# Altium schematic sheet GraduatedDesign_03.SchDoc
size A3; DocumentNumber: 1; SheetNumber: 1; SheetTotal: 1
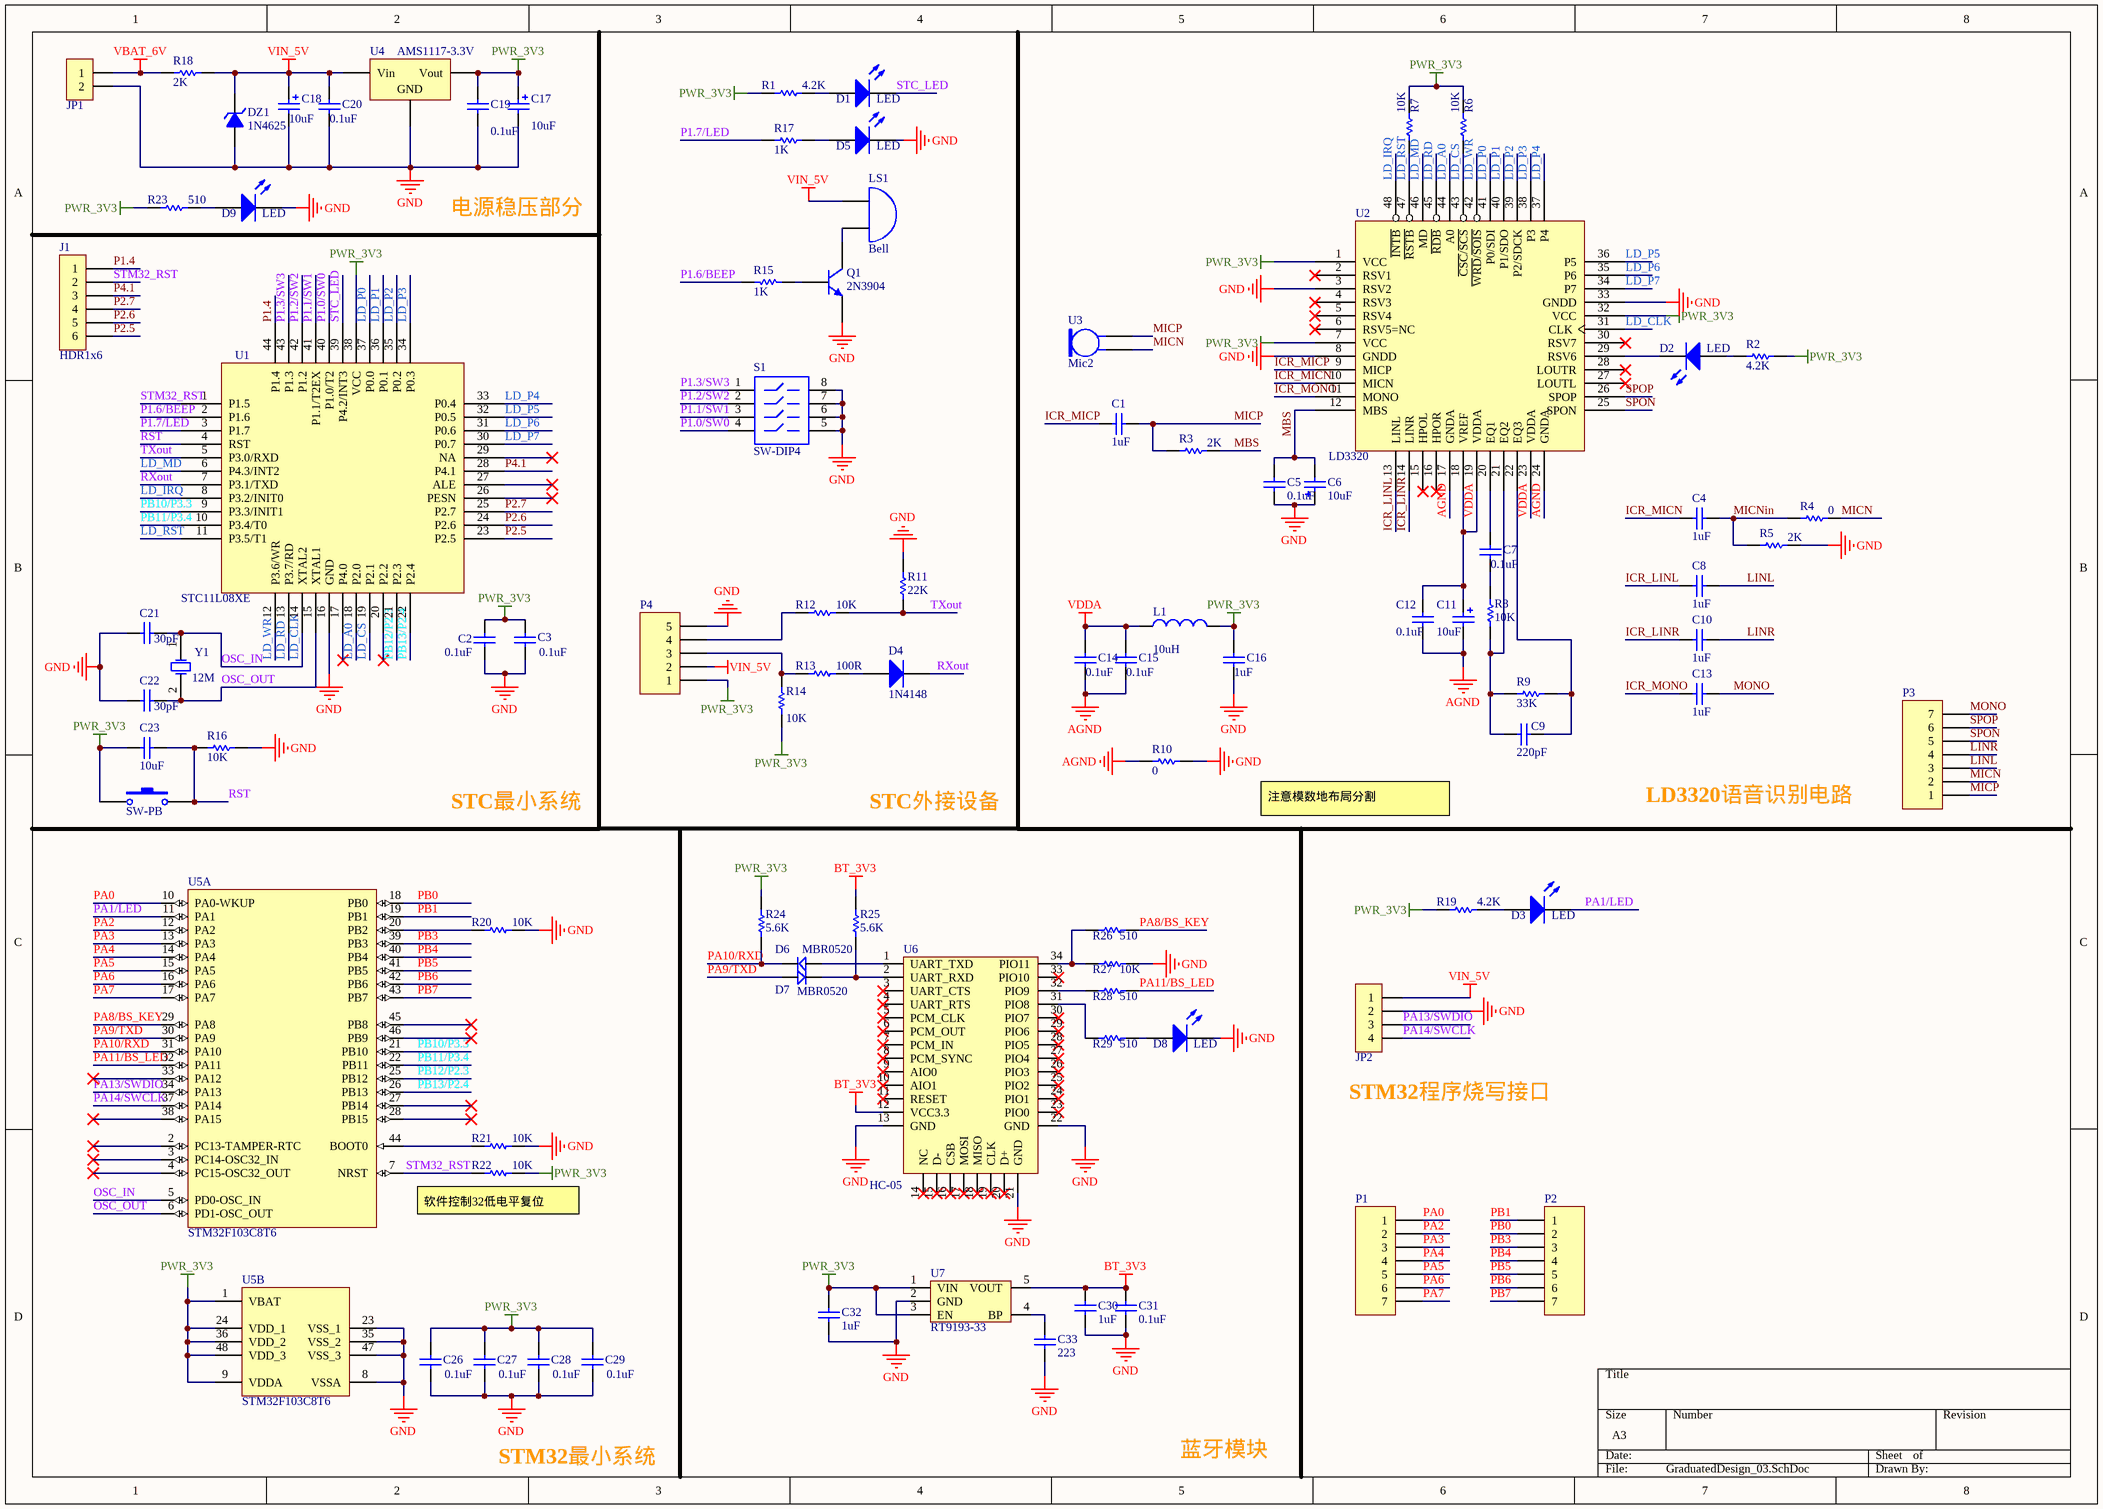
[diagram p0: GraduatedDesign_03.SchDoc]

## Parts
C1  value 1uF  [C0603]  (hidden comment: Cap)
C2  value 0.1uF  [C0603]  (hidden comment: Cap)
C3  value 0.1uF  [C0603]  (hidden comment: Cap)
C4  value 1uF  [C0603]  (hidden comment: Cap)
C5  value 0.1uF  [C0603]  (hidden comment: Cap)
C6  value 10uF  [C3216]  (hidden comment: Cap Pol2)
C7  value 0.1uF  [C0603]  (hidden comment: Cap)
C8  value 1uF  [C0603]  (hidden comment: Cap)
C9  value 220pF  [C0603]  (hidden comment: Cap)
C10  value 1uF  [C0603]  (hidden comment: Cap)
C11  value 10uF  [C3216]  (hidden comment: Cap Pol2)
C12  value 0.1uF  [C0603]  (hidden comment: Cap)
C13  value 1uF  [C0603]  (hidden comment: Cap)
C14  value 0.1uF  [C0603]  (hidden comment: Cap)
C15  value 0.1uF  [C0603]  (hidden comment: Cap)
C16  value 1uF  [C0603]  (hidden comment: Cap)
C17  value 10uF  [C3216]  (hidden comment: Cap Pol2)
C18  value 10uF  [C3216]  (hidden comment: Cap Pol2)
C19  value 0.1uF  [C0603]  (hidden comment: Cap)
C20  value 0.1uF  [C0603]  (hidden comment: Cap)
C21  value 30pF  [C0603]  (hidden comment: Cap)
C22  value 30pF  [C0603]  (hidden comment: Cap)
C23  value 10uF  [C0603]  (hidden comment: Cap)
C26  value 0.1uF  [C0603]  (hidden comment: Cap)
C27  value 0.1uF  [C0603]  (hidden comment: Cap)
C28  value 0.1uF  [C0603]  (hidden comment: Cap)
C29  value 0.1uF  [C0603]  (hidden comment: Cap)
C30  value 1uF  [C0603]  (hidden comment: Cap)
C31  value 0.1uF  [C0603]  (hidden comment: Cap)
C32  value 1uF  [C0603]  (hidden comment: Cap)
C33  value 223  [C0603]  (hidden comment: Cap)
D1  LED  [0603LED_GREEN]
D2  LED  [0603LED_RED]
D3  LED  [0603LED_GREEN]
D4  1N4148  [D1206]
D5  LED  [0603LED_GREEN]
D6  MBR0520  [SOD-123]
D7  MBR0520  [SOD-123]
D8  LED  [0603LED_GREEN]
D9  LED  [0603LED_GREEN]
DZ1  1N4625  [SOD-323]
J1  HDR1x6  [HDR1X6]
JP1  HDR-1X2  [HDR1X2]  (value not drawn)
JP2  HDR-1X4  [HDR1X4]  (value not drawn)
L1  value 10uH  [L0805]  (hidden comment: Inductor)
LS1  Bell  [BELL]
P1  Header 7H  [HDR1X7]  (value not drawn)
P2  Header 7H  [HDR1X7]  (value not drawn)
P3  Header 7H  [HDR1X7]  (value not drawn)
P4  Header 5H  [HDR1X5]  (value not drawn)
Q1  2N3904  [SOT-23]
R1  value 4.2K  [R0603]  (hidden comment: Res1)
R2  value 4.2K  [R0603]  (hidden comment: Res1)
R3  value 2K  [R0603]  (hidden comment: Res1)
R4  value 0  [R0603]  (hidden comment: Res1)
R5  value 2K  [R0603]  (hidden comment: Res1)
R6  value 10K  [R0603]  (hidden comment: Res1)
R7  value 10K  [R0603]  (hidden comment: Res1)
R8  value 10K  [R0603]  (hidden comment: Res1)
R9  value 33K  [R0603]  (hidden comment: Res1)
R10  value 0  [R0603]  (hidden comment: Res1)
R11  value 22K  [R0603]  (hidden comment: Res Semi)
R12  value 10K  [R0603]  (hidden comment: Res Semi)
R13  value 100R  [R0603]  (hidden comment: Res Semi)
R14  value 10K  [R0603]  (hidden comment: Res Semi)
R15  value 1K  [R0603]  (hidden comment: Res1)
R16  value 10K  [R0603]  (hidden comment: Res1)
R17  value 1K  [R0603]  (hidden comment: Res1)
R18  value 2K  [R0603]  (hidden comment: Res1)
R19  value 4.2K  [R0603]  (hidden comment: Res1)
R20  value 10K  [R0603]  (hidden comment: Res1)
R21  value 10K  [R0603]  (hidden comment: Res1)
R22  value 10K  [R0603]  (hidden comment: Res1)
R23  value 510  [R0603]  (hidden comment: Res1)
R24  value 5.6K  [R0603]  (hidden comment: Res1)
R25  value 5.6K  [R0603]  (hidden comment: Res1)
R26  value 510  [R0603]  (hidden comment: Res1)
R27  value 10K  [R0603]  (hidden comment: Res1)
R28  value 510  [R0603]  (hidden comment: Res1)
R29  value 510  [R0603]  (hidden comment: Res1)
S1  SW-DIP4  [DIP-8]
S2  SW-PB  [SPST-2]
U1  STC11L08XE  [QFP-44]
U2  LD3320  [LD3320A]
U3  Mic2  [PIN2]
U4  AMS1117-3.3V  [SOT223]
U5  STM32F103C8T6  [LQFP48_M]  (parts A,B of 2)
U6  HC-05  [HC-0x]
U7  RT9193-33  [SOT-23-5]
Y1  12M  [49/S_N]

## Nets
AGND: C11.2 C12.1 C14.1 C15.1 R10.2 U2.17(GNDA) U2.24(GNDA)
BT_3V3: C30.1 C31.1 R25.1 U6.12(VCC3.3) U7.5(VOUT)
GND: C2.1 C3.2 C5.2 C6.1 C16.1 C17.2 C18.2 C19.2 C20.1 C21.1 C22.1 C26.2 C27.2 C28.2 C29.2 C30.2 C31.2 C32.2 C33.2 D5.2(K) D8.2(K) D9.2(K) DZ1.1(A) JP1.2 JP2.2 P4.5 Q1.1(E) R5.2 R10.1 R11.2 R16.1 R20.1 R21.1 R27.1 S1.5 S1.6 S1.7 S1.8 U1.16(GND) U2.3(RSV2) U2.8(GNDD) U2.33(GNDD) U4.2(GND) U5.8(VSSA) U5.23(VSS_1) U5.35(VSS_2) U5.47(VSS_3) U6.13(GND) U6.21(GND) U6.22(GND) U7.2(GND)
PWR_3V3: C2.2 C3.1 C16.2 C17.1 C19.1 C23.2 C26.1 C27.1 C28.1 C29.1 C32.1 L1.2 P4.1 R1.1 R2.2 R6.1 R7.1 R14.2 R19.1 R22.1 R23.1 R24.1 S2.1 U1.38(VCC) U2.1(VCC) U2.7(VCC) U2.32(VCC) U4.3(Vout) U5.1(VBAT) U5.9(VDDA) U5.24(VDD_1) U5.36(VDD_2) U5.48(VDD_3) U7.1(VIN) U7.3(EN)
VBAT_6V: JP1.1 R18.2
VDDA: C11.1 C12.2 C14.2 C15.2 L1.1 U2.18(VREF) U2.19(VDDA) U2.23(VDDA)
VIN_5V: C18.1 C20.2 DZ1.2(K) JP2.1 LS1.2(B) P4.2 R18.1 U4.1(Vin)
ICR_LINL: C8.1 U2.13(LINL)
ICR_LINR: C10.1 U2.14(LINR)
ICR_MICN: C4.1 U2.10(MICN)
ICR_MICP: C1.1 U2.9(MICP)
ICR_MONO: C13.1 U2.11(MONO)
LD_A0: U1.18(P2.0) U2.44(A0)
LD_CLK: C21.2 U1.14(XTAL2) U2.31(CLK) U5.5(PD0-OSC_IN) Y1.1(OSC1)  [also labelled OSC_IN]
LD_CS: R6.2 U1.19(P2.1) U2.43(~{CSC}/~{SCS})
LD_IRQ: U1.8(P3.2/INIT0) U2.48(~{INTB})
LD_MD: U1.6(P4.3/INT2) U2.46(MD)
LD_P0: U1.37(P0.0) U2.41(P0/SDI)
LD_P1: U1.36(P0.1) U2.40(P1/SDO)
LD_P2: U1.35(P0.2) U2.39(P2/SDCK)
LD_P3: U1.34(P0.3) U2.38(P3)
LD_P4: U1.33(P0.4) U2.37(P4)
LD_P5: U1.32(P0.5) U2.36(P5)
LD_P6: U1.31(P0.6) U2.35(P6)
LD_P7: U1.30(P0.7) U2.34(P7)
LD_RD: U1.13(P3.7/RD) U2.45(~{RDB})
LD_RST: R7.2 U1.11(P3.5/T1) U2.47(~{RSTB})
LD_WR: U1.12(P3.6/WR) U2.42(~{WRD}/~{SOIS})
LINL: C8.2 P3.3
LINR: C10.2 P3.4
MBS: C5.1 C6.2 R3.2 U2.12(MBS)
MICN: P3.2 R4.2 U3.1
MICNin: C4.2 R4.1 R5.1
MICP: C1.2 P3.1 R3.1 U3.2
MONO: C13.2 P3.7
OSC_OUT: C22.2 U1.15(XTAL1) U5.6(PD1-OSC_OUT) Y1.2(OSC2)
P1.0/SW0: S1.4 U1.40(P1.0/T2)
P1.1/SW1: S1.3 U1.41(P1.1/T2EX)
P1.2/SW2: S1.2 U1.42(P1.2)
P1.3/SW3: S1.1 U1.43(P1.3)
P1.4: J1.1 U1.44(P1.4)
P1.6/BEEP: R15.1 U1.2(P1.6)
P1.7/LED: R17.1 U1.3(P1.7)
P2.5: J1.6 U1.23(P2.5)
P2.6: J1.5 U1.24(P2.6)
P2.7: J1.4 U1.25(P2.7)
P4.1: J1.3 U1.28(P4.1)
PA0: P1.1 U5.10(PA0-WKUP)
PA1/LED: D3.2(K) U5.11(PA1)
PA2: P1.2 U5.12(PA2)
PA3: P1.3 U5.13(PA3)
PA4: P1.4 U5.14(PA4)
PA5: P1.5 U5.15(PA5)
PA6: P1.6 U5.16(PA6)
PA7: P1.7 U5.17(PA7)
PA8/BS_KEY: R26.1 U5.29(PA8)
PA9/TXD: D7.1 U5.30(PA9)
PA10/RXD: D6.2 R24.2 U5.31(PA10)
PA11/BS_LED: R28.1 U5.32(PA11)
PA13/SWDIO: JP2.3 U5.34(PA13)
PA14/SWCLK: JP2.4 U5.37(PA14)
PB0: P2.2 U5.18(PB0)
PB1: P2.1 U5.19(PB1)
PB3: P2.3 U5.39(PB3)
PB4: P2.4 U5.40(PB4)
PB5: P2.5 U5.41(PB5)
PB6: P2.6 U5.42(PB6)
PB7: P2.7 U5.43(PB7)
PB10/P3.3: U1.9(P3.3/INIT1) U5.21(PB10)
PB11/P3.4: U1.10(P3.4/T0) U5.22(PB11)
PB12/P2.3: U1.21(P2.3) U5.25(PB12)
PB13/P2.4: U1.22(P2.4) U5.26(PB13)
RST: C23.1 R16.2 S2.2 U1.4(RST)
RXout: D4.2(K) U1.7(P3.1/TXD)
SPON: P3.5 U2.25(SPON)
SPOP: P3.6 U2.26(SPOP)
STC_LED: D1.2(K) U1.39(P4.2/INT3)
STM32_RST: J1.2 R22.2 U1.1(P1.5) U5.7(NRST)
TXout: R11.1 R12.2 U1.5(P3.0/RXD)
NetC7_1: C7.1 R8.2
NetC7_2: C7.2 U2.20(EQ1)
NetC9_1: C9.1 R9.1 U2.22(EQ3)
NetC9_2: C9.2 R8.1 R9.2 U2.21(EQ2)
NetC33_1: C33.1 U7.4(BP)
NetD1_1: D1.1(A) R1.2
NetD2_1: D2.1(A) R2.1
NetD2_2: D2.2(K) U2.29(RSV6)
NetD3_1: D3.1(A) R19.2
NetD4_1: D4.1(A) R13.2
NetD5_1: D5.1(A) R17.2
NetD6_1: D6.1 U6.1(UART_TXD)
NetD7_2: D7.2 R25.2 U6.2(UART_RXD)
NetD8_1: D8.1(A) R29.1
NetD9_1: D9.1(A) R23.2
NetLS1_1: LS1.1(A) Q1.3(C)
NetP4_3: P4.3 R13.1 R14.1
NetP4_4: P4.4 R12.1
NetQ1_2: Q1.2(B) R15.2
NetR20_2: R20.2 U5.20(PB2)
NetR21_2: R21.2 U5.44(BOOT0)
NetR26_2: R26.2 R27.2 U6.34(PIO11)
NetR28_2: R28.2 U6.32(PIO9)
NetR29_2: R29.2 U6.31(PIO8)

Not connected (* = marked no-connect by the designer): U1 17(P4.0)* 20(P2.2)* 26(PESN)* 27(ALE)* 29(NA)*; U2 2(RSV1)* 4(RSV3)* 5(RSV4)* 6(RSV5=NC)* 15(HPOL)* 16(HPOR)* 27(LOUTL)* 28(LOUTR)* 30(RSV7)*; U5 2(PC13-TAMPER-RTC)* 3(PC14-OSC32_IN)* 4(PC15-OSC32_OUT)* 27(PB14)* 28(PB15)* 33(PA12)* 38(PA15)* 45(PB8)* 46(PB9)*; U6 3(UART_CTS)* 4(UART_RTS)* 5(PCM_CLK)* 6(PCM_OUT)* 7(PCM_IN)* 8(PCM_SYNC)* 9(AIO0)* 10(AIO1)* 11(RESET)* 14(NC)* 15(D-)* 16(CSB)* 17(MOSI)* 18(MISO)* 19(CLK)* 20(D+)* 23(PIO0)* 24(PIO1)* 25(PIO2)* 26(PIO3)* 27(PIO4)* 28(PIO5)* 29(PIO6)* 30(PIO7)* 33(PIO10)*

## Notes on the sheet
- 电源稳压部分
- STC最小系统
- STC外接设备
- 注意模数地布局分割
- LD3320语音识别电路
- (near JP2) STM32程序烧写接口
- (near R22) 软件控制32低电平复位
- 蓝牙模块
- STM32最小系统

## Library data of the parts
C1-C5 C7-C10 C12-C16 C19-C23 C26-C33 = Cap: Capacitor; Published: 8-Jun-2000; LatestRevisionDate: 17-Jul-2002; LatestRevisionNote: Re-released for DXP Platform.; PackageReference: RAD-0.3; Publisher: Altium Limited; PackageDescription: Radial Cap, Thru-Hole; 2 Leads; 0.3 in Pin Spacing
C6 C11 C17 C18 = Cap Pol2: Polarized Capacitor (Axial); Published: 8-Jun-2000; LatestRevisionDate: 17-Jul-2002; LatestRevisionNote: Re-released for DXP Platform.; PackageReference: POLAR0.8; Publisher: Altium Limited; PackageDescription: Polarized Capacitor; 2 Leads
D1-D3 D5 D8 D9 = LED0: Typical INFRARED GaAs LED; Published: 8-Jun-2000; LatestRevisionDate: 08-Jul-2005; LatestRevisionNote: Mech Layer 1 removed.; PackageReference: LED-0; Publisher: Altium Limited; PackageDescription: LED; 2 Leads
D4 = Diode 1N4148: High Conductance Fast Diode; Published: 8-Jun-2000; LatestRevisionDate: 17-Jul-2002; LatestRevisionNote: Re-released for DXP Platform.; DatasheetVersion: 1997; PackageReference: DO-35; Publisher: Altium Limited; PackageDescription: Diode, Axial; Body 3.8 x 1.9 mm (LxDia. max), Lead Dia. 0.53 mm (max); Code_JEDEC: DO-204-AH; ComponentLink1Description: Manufacturer Link; ComponentLink1URL: http://www.fairchildsemi.com/; ComponentLink2Description: Datasheet; ComponentLink2URL: http://www.fairchildsemi.com/ds/1N%2F1N4148.pdf
D6 D7 = D: 1N4148
DZ1 = 1N4625: 5.1V/0.5W稳压管; 版权归属: 黎明电子style; BOM名称: 5.1V/0.5W稳压管; 学习资源: https://lmdzstyle.taobao.com/
J1 = HDR1x6: Connector
JP1 = Header 2: 2P接插件; 版权归属: 黎明电子style; BOM名称: 2P接插件; 学习资源: https://lmdzstyle.taobao.com/
JP2 = Header 4: 4P接插件; 版权归属: 黎明电子style; BOM名称: 4P接插件; 学习资源: https://lmdzstyle.taobao.com/
L1 = Inductor: Code_IEC: 1005; Published: 8-Jun-2000; LatestRevisionDate: 29-May-2009; LatestRevisionNote: IPC-7351 Footprint Added.; PackageReference: 0402-A; Publisher: Altium Limited; PackageDescription: Chip Inductor; Code_JEITA: 0402
LS1 = Bell: Electrical Bell; Published: 24-Mar-1999; LatestRevisionDate: 17-Jul-2002; LatestRevisionNote: Re-released for DXP Platform.; PackageReference: PIN2; Publisher: Altium Limited
P1-P3 = Header 7H: Header, 7-Pin, Right Angle; LatestRevisionDate: 17-Jul-2002; LatestRevisionNote: Re-released for DXP Platform.; Publisher: Altium Limited
P4 = Header 5H: Header, 5-Pin, Right Angle; LatestRevisionDate: 17-Jul-2002; LatestRevisionNote: Re-released for DXP Platform.; Publisher: Altium Limited
Q1 = 2N3904: NPN General Purpose Amplifier; Published: 8-Jun-2000; LatestRevisionDate: 15-Jan-2003; LatestRevisionNote: PCB Footprint 'BCY-W3/D4.7' replaced; DatasheetVersion: 1997; PackageVersion: Sep-1998; PackageReference: TO-92A; Publisher: Altium Limited; Code_JEDEC: TO-92A; ComponentLink1Description: Manufacturer Link; ComponentLink1URL: http://www.fairchildsemi.com/; ComponentLink2Description: Datasheet; ComponentLink2URL: http://www.fairchildsemi.com/ds/2N%2F2N3904.pdf
R1-R10 R15-R29 = Res1: Resistor; Published: 8-Jun-2000; LatestRevisionDate: 17-Jul-2002; LatestRevisionNote: Re-released for DXP Platform.; PackageReference: AXIAL-0.3; Publisher: Altium Limited; PackageDescription: Axial Device, Thru-Hole; 2 Leads; 0.3 in Pin Spacing
R11-R14 = Res Semi: Semiconductor Resistor; Published: 8-Jun-2000; LatestRevisionDate: 17-Jul-2002; LatestRevisionNote: Re-released for DXP Platform.; PackageReference: AXIAL-0.5; Publisher: Altium Limited; PackageDescription: Axial Device, Thru-Hole; 2 Leads; 0.5 in Pin Spacing
S1 = SW-DIP4: DIP Switch; Published: 24-Mar-1999; LatestRevisionDate: 17-Jul-2002; LatestRevisionNote: Re-released for DXP Platform.; PackageReference: DIP-8; Publisher: Altium Limited
S2 = SW-PB: Switch; Published: 24-Mar-1999; LatestRevisionDate: 17-Jul-2002; LatestRevisionNote: Re-released for DXP Platform.; PackageReference: SPST-2; Publisher: Altium Limited
U1 = STC11L08XE: STC11L08XE: U?
U2 = LD3320A
U3 = Mic2: Microphone; Published: 24-Mar-1999; LatestRevisionDate: 17-Jul-2002; LatestRevisionNote: Re-released for DXP Platform.; PackageReference: PIN2; Publisher: Altium Limited
U4 = Volt Reg: Voltage Regulator; Published: 24-Mar-1999; LatestRevisionDate: 29-May-2009; LatestRevisionNote: IPC-7351 Footprint Added.; PackageReference: D2PAK; Publisher: Altium Limited; PackageDescription: 3-Pin Transistor Outline Package 2.54 mm Pitch, 15.1 mm Lead Span
U5 = STM32F103C8T6: ARM Cortex-M3 32-bit MCU, 64 KB Flash, 20 KB Internal RAM, 37 I/Os, 48-pin LQFP, -40 to 85 degC, Tray; A/D Converter: 2x12-bit (10 Channel); FLASH Size (Prog) (kB): 64; I/Os (High Current): 37; Internal RAM Size (kB): 20; Operating Frequency(F) (Processor speed) (MHz): 72; Supply Voltage(Vcc) min (V): 2; DatasheetVersion: Rev. 16; PackageVersion: Rev. 6, 06/2013; PackageReference: LQFP48; PackageDescription: 48-Pin Low Profile Quad Flat Package, 7 x 7 mm Body, 0.5 mm Pitch; Supplier 1: Digi-Key; Supplier Part Number 1: 497-6063-ND; Supplier 2: Farnell; Supplier Part Number 2: 1447637; Supplier 3: Newark; Supplier Part Number 3: 59M2182; Supplier 4: Newark; Supplier Part Number 4: 57P1222; Supplier 5: Mouser; Supplier Part Number 5: 511-STM32F103C8T6; Core: ARM Cortex-M3; Packing: Tray; Mounting Technology: Surface Mount; PartNumber: STM32F103C8T6; ComponentLink1Description: Manufacturer URL; ComponentLink1URL: http://www.st.com/web/en/home.html; ComponentLink2Description: Datasheet; ComponentLink2URL: http://www.st.com/st-web-ui/static/active/en/resource/technical/document/datasheet/CD00161566.pdf; ComponentLink3Description: Package Specification; ComponentLink3URL: http://www.st.com/st-web-ui/static/active/en/resource/technical/document/datasheet/DM00058181.pdf
U6 = HC-05: 蓝牙串口模块
U7 = RT9193-33: 3.3V超低压差LDO
Y1 = XTAL: Crystal Oscillator; Published: 8-Jun-2000; LatestRevisionDate: 17-Jul-2002; LatestRevisionNote: Re-released for DXP Platform.; PackageReference: R38; Publisher: Altium Limited; PackageDescription: Crystal, Thru-Hole; 2 Leads; Body 3.1 x 8.2 mm (Dia.xH)